# Altium schematic sheet [06] Connectors.SchDoc
size A
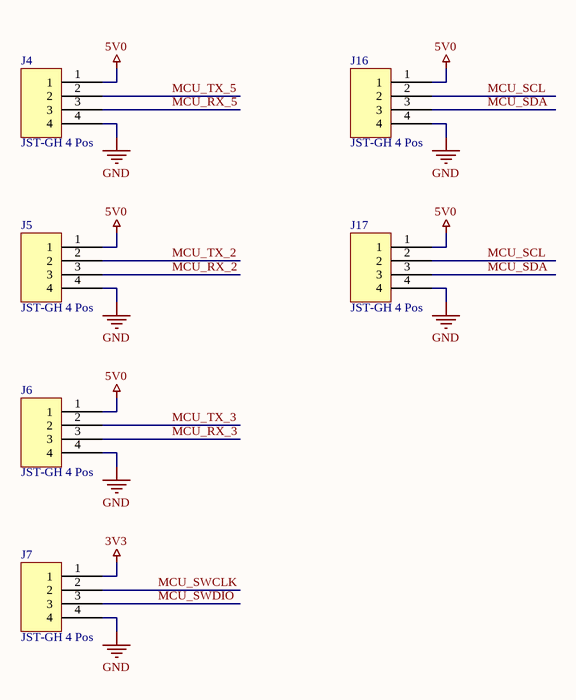
[diagram p0: [06] Connectors.SchDoc]

## Parts
J4  JST-GH 4 Pos  [SM04B-GHS-TB(LF)(SN)-]
J5  JST-GH 4 Pos  [SM04B-GHS-TB(LF)(SN)-]
J6  JST-GH 4 Pos  [SM04B-GHS-TB(LF)(SN)-]
J7  JST-GH 4 Pos  [SM04B-GHS-TB(LF)(SN)-]
J16  JST-GH 4 Pos  [SM04B-GHS-TB(LF)(SN)-]
J17  JST-GH 4 Pos  [SM04B-GHS-TB(LF)(SN)-]

## Nets
3V3: J7.1
5V0: J4.1 J5.1 J6.1 J16.1 J17.1
GND: J4.4 J5.4 J6.4 J7.4 J16.4 J17.4
MCU_RX_2: J5.3
MCU_RX_3: J6.3
MCU_RX_5: J4.3
MCU_SCL: J16.2 J17.2
MCU_SDA: J16.3 J17.3
MCU_SWCLK: J7.2
MCU_SWDIO: J7.3
MCU_TX_2: J5.2
MCU_TX_3: J6.2
MCU_TX_5: J4.2

## Library data of the parts
J4-J7 J16 J17 = SM04B-GHS-TB(LF)(SN)-: JST-GH CONN HEADER SMD R/A 4 POS 1.25MM; Manufacturer: JST; Connector Type: Outer Shroud Contact; Number of Positions: 4; Pitch: 0.049inch; Supplier 1: Digi-Key; Manufacturer Part Number: SM04B-GHS-TB(LF)(SN)-; RoHS: Yes; Category: Connectors; Stock 1: 34258; Pricing 1: 1=0.45000, 10=0.42300, 100=0.32440, 500=0.28212, 1000=0.23274 (USD); Mount: Surface Mount; Color: Natural; Contact Plating: Tin; Number of Rows: 1; Fastening Type: Ramp; Packaging: Cut Tape; Termination: Solder; ComponentLink1URL: https://datasheet.ciiva.com/6832/egh-6832463.pdf?src-supplier=Digi-Key; ComponentLink1Description: https://datasheet.ciiva.com/6832/egh-6832463.pdf?src-supplier=Digi-Key; Supplier Part Number 1: 455-1566-1-ND